# EasyEDA Pro project stm32_无人机.eprj, board PCB1
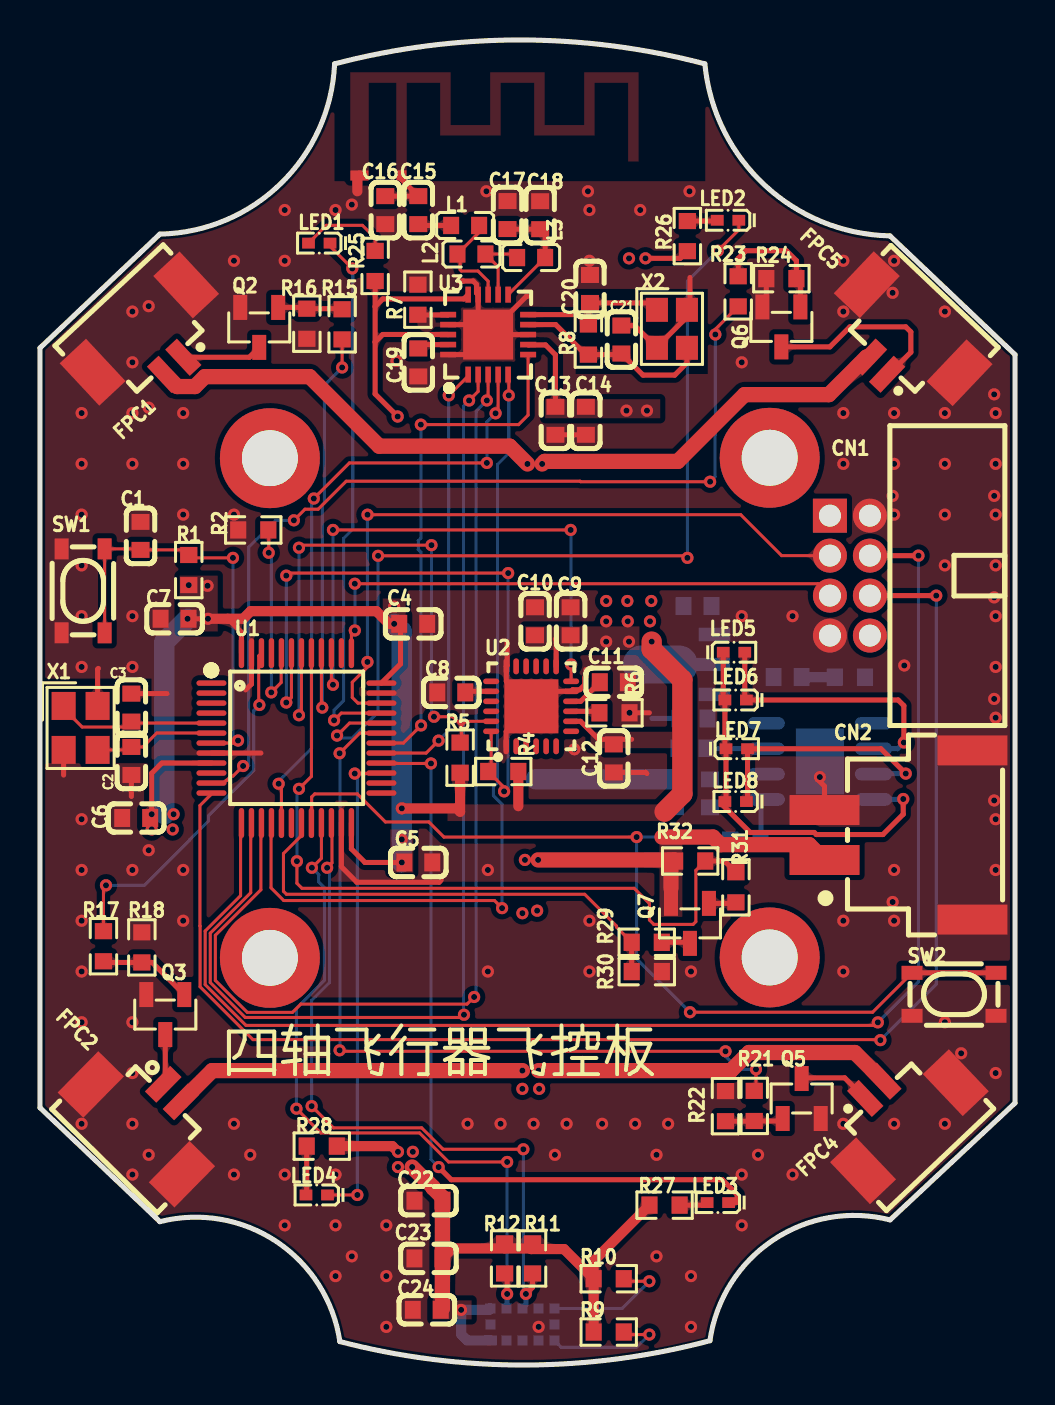
[diagram p11: board, top side]
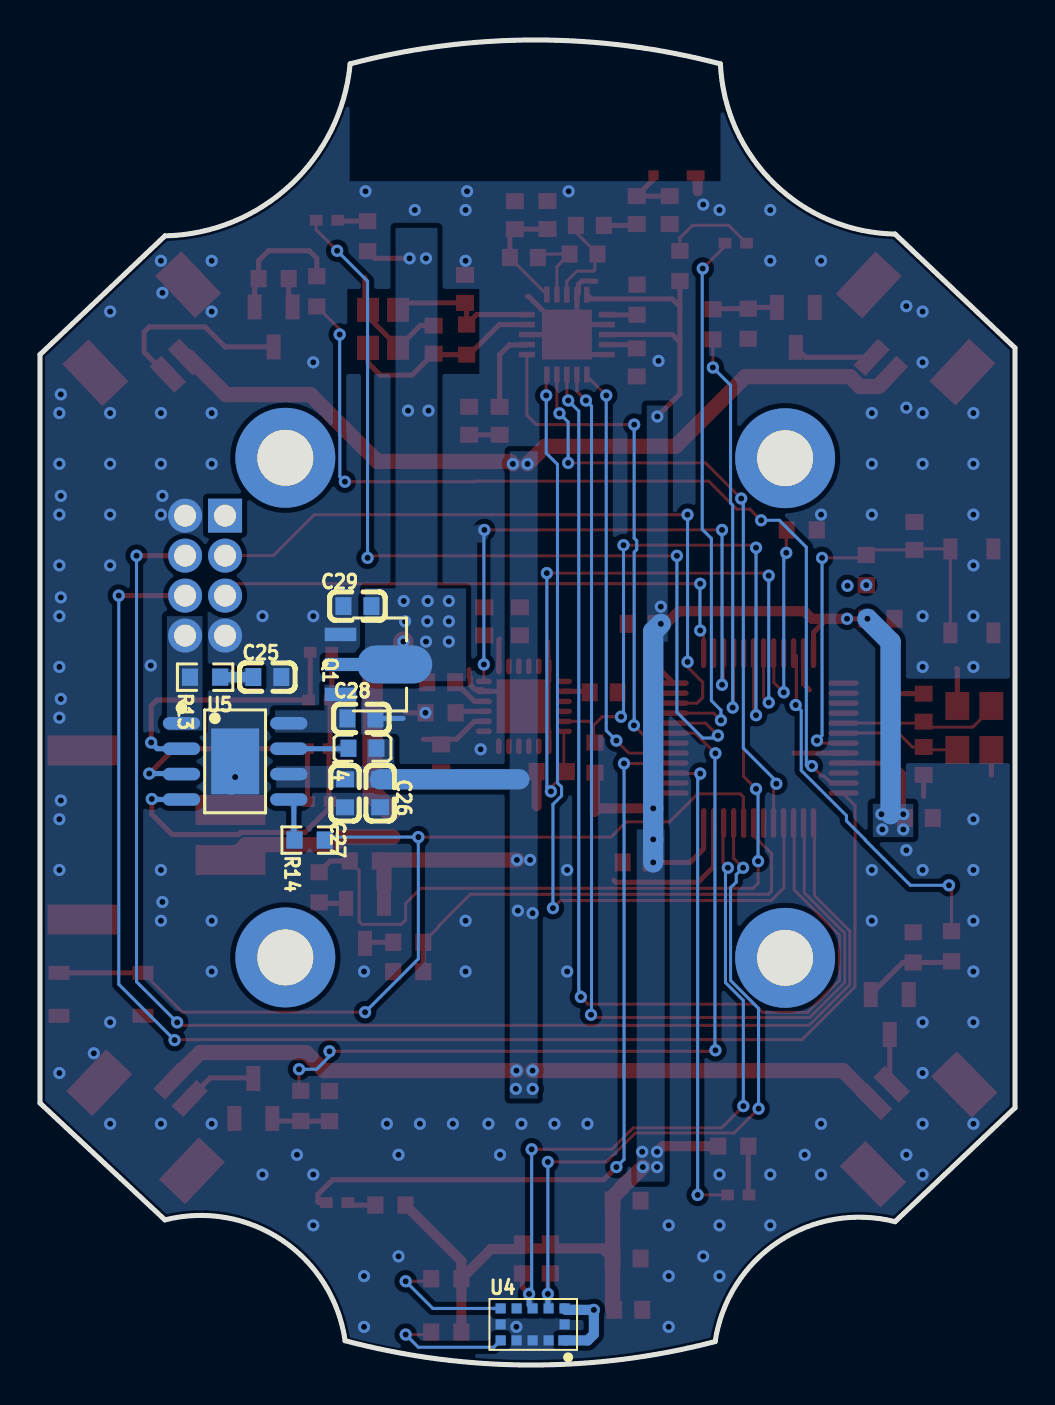
[diagram p12: board, bottom side, seen from below]

Outline 48.77 x 66.3 mm; copper layers: Top Layer, Bottom Layer. Coordinates in mm from the lower left corner of the outline.
Outline path: 0,50.89 6,56.59 arc(12.04,59.11) 14.74,65.1 arc(23.99,66.3) 33.26,65.1 arc(36.26,59.03) 42.52,56.5 48.77,50.55 48.77,13.11 42.52,7.26 arc(36.69,6.26) 33.51,1.22 arc(24.25,0) 15,1.17 arc(11.83,6.17) 6,7.17 0,12.87 0,50.89
Stack: Top Layer 0.035mm / Dielectric1 1.51mm FR4 er 4.5 / Bottom Layer 0.035mm

## Design rules (mm)
template: 自定义配置
spacing copperThickness1oz (default): track to track 0.102, other pairs 0 to 0.3
spacing copperThickness2oz: track to track 0.203, other pairs 0.152 to 0.3
track width copperThickness1oz (default): min 0.127, default 0.254, max 2.54
track width copperThickness2oz: min 0.203, default 0.254, max 2.54
differential pair differentialPair (default): width min 0.127, default 0.254, max 2.54; gap min 0.152, default 0.152
via viaSize (default): diameter min 0.5, default 0.61, max 10; hole min 0.3, default 0.305, max 6.3

## Placement (name value [footprint] x y rotation side)
C1  100nF  [C0603]  5.03 41.49 270 top
C2  12pF  [C0603]  4.57 30.23 90 top
C3  12pF  [C0603]  4.57 32.89 90 top
C4  100nF  [C0603]  18.67 37.08 180 top
C5  100nF  [C0603]  18.92 25.15 180 top
C6  100nF  [C0603]  4.81 27.37 0 top
C7  100nF  [C0603]  6.73 37.34 0 top
C8  10nF  [C0603]  20.57 33.66 180 top
C9  100nF  [C0603]  26.54 37.21 90 top
C10  2.2uF  [C0603]  24.76 37.21 90 top
C11  100nF  [C0603]  28.7 34.16 180 top
C12  10nF  [C0603]  28.7 30.35 270 top
C13  100nF  [C0603]  25.78 47.24 90 top
C14  10uF  [C0603]  27.31 47.24 90 top
C15  1.5pF  [C0603]  18.92 57.79 90 top
C16  1pF  [C0603]  17.27 57.79 90 top
C17  4.7pF  [C0603]  23.39 57.54 270 top
C18  2.2nF  [C0603]  25.02 57.53 270 top
C19  33nF  [C0603]  18.92 50.17 90 top
C20  22pF  [C0603]  27.51 53.84 90 top
C21  22pF  [C0603]  29.08 51.31 270 top
C22  4.7uF  [C0603]  19.43 8.22 0 top
C23  100nF  [C0603]  19.43 5.33 0 top
C24  1pF  [C0603]  19.35 2.76 0 top
C25  2.2uF  [C0603]  37.4 34.42 180 bottom
C26  10uF  [C0603]  31.76 28.61 90 bottom
C27  10uF  [C0603]  33.51 28.61 90 bottom
C28  10uF  [C0603]  32.69 32.35 0 bottom
C29  10uF  [C0603]  32.89 37.97 0 bottom
CN1  3111-08RG0BK00T1  [CONN-TH_3111-08RG0BK00T1]  40.51 39.5 270 top
CN2  ZX-XH2.54-2PWT  [CONN-SMD_2P-P2.54_MEGASTAR_ZX-XH2.54-2PWT]  42.94 26.52 90 top
FPC1  1.25-2PWB  [CONN-SMD_2P-P1.25_DEALON_1.25-2PWB]  5.84 50.93 223 top
FPC2  1.25-2PWB  [CONN-SMD_2P-P1.25_DEALON_1.25-2PWB]  5.72 12.7 315.4 top
FPC4  1.25-2PWB  [CONN-SMD_2P-P1.25_DEALON_1.25-2PWB]  42.61 12.85 43.5 top
FPC5  1.25-2PWB  [CONN-SMD_2P-P1.25_DEALON_1.25-2PWB]  42.8 50.93 136.5 top
L1  3.9nH  [L0603]  21.27 57.02 180 top
L2  8.2nH  [L0603]  21.58 55.59 180 top
L3  2.7nH  [L0603]  24.57 55.41 0 top
L4  1.5uH  [L0603]  32.64 30.86 180 bottom
LED1  XL-1005UYC  [LED0402-FD_YELLOW]  13.97 56.13 0 top
LED2  XL-1005UYC  [LED0402-FD_YELLOW]  34.42 57.28 0 top
LED3  XL-1005UYC  [LED0402-FD_YELLOW]  33.91 8.13 0 top
LED4  XL-1005UYC  [LED0402-FD_YELLOW]  13.84 8.51 0 top
LED5  XL-1005UYC  [LED0402-FD_YELLOW]  34.72 35.66 180 top
LED6  XL-1005UYC  [LED0402-FD_YELLOW]  34.8 33.27 0 top
LED7  XL-1005UYC  [LED0402-FD_YELLOW]  34.85 30.84 180 top
LED8  XL-1005UYC  [LED0402-FD_YELLOW]  34.8 28.19 0 top
NOREF  -  [Pad_e117]  36.5 45.39 0 top
NOREF#2  -  [Pad_e114]  11.5 20.37 0 top
NOREF#3  -  [Pad_e118]  36.5 20.39 0 top
NOREF#4  -  [Pad_e5883]  18.08 59.53 0 top
NOREF#5  -  [Pad_e116]  11.5 45.37 0 top
NOREF#6  -  [Pad_e5882]  15.98 59.52 0 top
Q1  AMS1117-3.3V  [SOT-89-3_L4.5-W2.5-P1.50-LS4.2-BR]  32.38 35.05 0 bottom
Q2  AO3400A  [SOT-23-3_L2.9-W1.3-P1.90-LS2.4-BR]  10.97 51.92 90 top
Q3  AO3400A  [SOT-23-3_L2.9-W1.3-P1.90-LS2.4-BR]  6.27 17.54 90 top
Q5  AO3400A  [SOT-23-3_L2.9-W1.3-P1.90-LS2.4-BR]  38.1 13.34 270 top
Q6  AO3400A  [SOT-23-3_L2.9-W1.3-P1.90-LS2.4-BR]  37.08 51.94 90 top
Q7  SI2301A  [SOT-23-3_L2.9-W1.3-P1.90-LS2.4-BR]  32.51 22.1 90 top
R1  10KΩ  [R0603]  7.44 39.78 270 top
R2  10K  [R0603]  10.67 41.78 180 top
R4  10KΩ  [R0603]  23.17 29.7 0 top
R5  10KΩ  [R0603]  21.01 30.39 270 top
R6  10K  [R0603]  28.74 32.63 180 top
R7  22K  [R0603]  18.9 53.3 90 top
R8  1MΩ  [R0603]  27.43 51.31 90 top
R9  10K  [R0603]  28.45 1.65 0 top
R10  10K  [R0603]  28.45 4.32 0 top
R11  10K  [R0603]  24.64 5.33 270 top
R12  10K  [R0603]  23.24 5.33 270 top
R13  1.5Ω  [R0603]  40.51 34.42 180 bottom
R14  10KΩ  [R0603]  35.28 26.27 180 bottom
R15  1KΩ  [R0603]  15.11 52.07 90 top
R16  10K  [R0603]  13.35 52.1 90 top
R17  1KΩ  [R0603]  3.17 20.96 270 top
R18  10K  [R0603]  5.09 20.9 270 top
R21  1KΩ  [R0603]  35.73 12.96 270 top
R22  10K  [R0603]  34.29 12.95 270 top
R23  1KΩ  [R0603]  34.93 53.72 90 top
R24  10K  [R0603]  37.08 54.36 0 top
R25  10K  [R0603]  16.76 54.99 270 top
R26  10K  [R0603]  32.38 56.49 270 top
R27  10K  [R0603]  31.24 8 180 top
R28  10K  [R0603]  14.09 10.95 0 top
R29  100KΩ  [R0603]  30.35 21.15 0 top
R30  100KΩ  [R0603]  30.35 19.69 180 top
R31  1KΩ  [R0603]  34.81 23.9 90 top
R32  100KΩ  [R0603]  32.52 25.22 0 top
SW1  SKRPACE010  [KEY-SMD_4P-L4.2-W3.2-P2.20-LS4.6]  2.16 38.74 270 top
SW2  SKRPACE010  [KEY-SMD_4P-L4.2-W3.2-P2.20-LS4.6]  45.72 18.55 0 top
U1  STM32F103C8T6  [LQFP-48_L7.0-W7.0-P0.50-LS9.0-BL]  12.83 31.37 270 top
U2  MPU-6050  [QFN-24_L4.0-W4.0-P0.50-BL-EP2.7]  24.57 32.96 0 top
U3  Si24R1  [QFN-20_L4.0-W4.0-P0.50-BL-EP]  22.42 51.56 0 top
U4  VL53L4CDV0DH/1  [LGA-12_L4.4-W2.4_VL53L0X]  24.13 2.03 180 bottom
U5  TP4336  [ESOP-8_L4.9-W3.9-P1.27-LS6.0-BL-EP-1]  39.01 30.2 270 bottom
X1  8MHz  [CRYSTAL-SMD_4P-L3.2-W2.5-BL]  2.03 31.88 270 top
X2  -  [CRYSTAL-SMD_4P-L2.5-W2.0-BL-2]  31.61 51.85 270 top

## Footprints (pads in the part's own frame, mm; a bottom-side part is the same pattern mirrored in y, then rotated)
C0603
  rect 0.8x0.9 smd: 1(-0.7,0) 2(0.7,0)
CONN-SMD_2P-P1.25_DEALON_1.25-2PWB
  rect 0.8x1.8 smd: 1(-0.625,1.275) 2(0.625,1.275)
  rect 1.8x2.9 smd: 3(-3.2,-1.275) 4(3.2,-1.275)
CONN-SMD_2P-P2.54_MEGASTAR_ZX-XH2.54-2PWT
  rect 1.5x3.5 smd: 1(-1.25,3.7) 2(1.25,3.7) 3(-4.23,-3.7) 4(4.23,-3.7)
CONN-TH_3111-08RG0BK00T1
  rect 1.7x1.7 hole 1.1: 1(-3,-1)
  round 1.7 hole 1.1: 2(-3,1) 3(-1,-1) 4(-1,1) 5(1,-1) 6(1,1) 7(3,-1) 8(3,1)
CRYSTAL-SMD_4P-L2.5-W2.0-BL-2
  rect 1.2x1.1 smd: 1(-0.95,-0.75) 2(0.95,-0.75) 3(0.95,0.75) 4(-0.95,0.75)
CRYSTAL-SMD_4P-L3.2-W2.5-BL
  rect 1.4x1.2 smd: 1(-1.1,-0.85) 2(1.1,-0.85) 3(1.1,0.85) 4(-1.1,0.85)
ESOP-8_L4.9-W3.9-P1.27-LS6.0-BL-EP-1
  oval 0.63x1.865 smd: 1(-1.905,-2.683) 2(-0.635,-2.683) 3(0.635,-2.683) 4(1.905,-2.683) 5(1.905,2.683) 6(0.635,2.683) 7(-0.635,2.683) 8(-1.905,2.683)
  rect 3.3x2.4 smd: 9(0,0)
KEY-SMD_4P-L4.2-W3.2-P2.20-LS4.6
  rect 1.05x0.7 smd: 1(-2.1,1.075) 2(2.1,1.075) 3(-2.1,-1.075) 4(2.1,-1.075)
L0603
  rect 0.8x0.864 smd: 1(-0.7,0) 2(0.7,0)
LED0402-FD_YELLOW
  rect 0.636x0.54 smd: 1(-0.538,0) 2(0.538,0)
LGA-12_L4.4-W2.4_VL53L0X
  custom 0.635x0.508 smd: 1(1.6,-0.8)
  rect 0.508x0.508 smd: 2(0.8,-0.8) 3(0,-0.8) 4(-0.8,-0.8) 5(-1.6,-0.8) 6(-1.6,0) 7(-1.6,0.8) 8(-0.8,0.8) 9(0,0.8) 10(0.8,0.8) 11(1.6,0.8) 12(1.6,0)
LQFP-48_L7.0-W7.0-P0.50-LS9.0-BL
  oval 0.27x1.5 smd: 1(-2.75,-4.25) 2(-2.25,-4.25) 3(-1.75,-4.25) 4(-1.25,-4.25) 5(-0.75,-4.25) 6(-0.25,-4.25) 7(0.25,-4.25) 8(0.75,-4.25) 9(1.25,-4.25) 10(1.75,-4.25) 11(2.25,-4.25) 12(2.75,-4.25) 25(2.75,4.25) 26(2.25,4.25) 27(1.75,4.25) 28(1.25,4.25) 29(0.75,4.25) 30(0.25,4.25) 31(-0.25,4.25) 32(-0.75,4.25) 33(-1.25,4.25) 34(-1.75,4.25) 35(-2.25,4.25) 36(-2.75,4.25)
  oval 1.5x0.27 smd: 13(4.25,-2.75) 14(4.25,-2.25) 15(4.25,-1.75) 16(4.25,-1.25) 17(4.25,-0.75) 18(4.25,-0.25) 19(4.25,0.25) 20(4.25,0.75) 21(4.25,1.25) 22(4.25,1.75) 23(4.25,2.25) 24(4.25,2.75) 37(-4.25,2.75) 38(-4.25,2.25) 39(-4.25,1.75) 40(-4.25,1.25) 41(-4.25,0.75) 42(-4.25,0.25) 43(-4.25,-0.25) 44(-4.25,-0.75) 45(-4.25,-1.25) 46(-4.25,-1.75) 47(-4.25,-2.25) 48(-4.25,-2.75)
Pad_e114
  round 5 hole 2.8: 1(0,0)
Pad_e116
  round 5 hole 2.8: 1(0,0)
Pad_e117
  round 5 hole 2.8: 1(0,0)
Pad_e118
  round 5 hole 2.8: 1(0,0)
Pad_e5882
  rect 0.9x0.5 smd: 2(0,0)
Pad_e5883
  rect 0.5x0.5 smd: 1(0,0)
QFN-20_L4.0-W4.0-P0.50-BL-EP
  rect 0.28x0.8 smd: 1(-1,-2) 2(-0.5,-2) 3(0,-2) 4(0.5,-2) 5(1,-2) 11(1,2) 12(0.5,2) 13(0,2) 14(-0.5,2) 15(-1,2)
  rect 0.8x0.28 smd: 6(2,-1) 7(2,-0.5) 8(2,0) 9(2,0.5) 10(2,1) 16(-2,1) 17(-2,0.5) 18(-2,0) 19(-2,-0.5) 20(-2,-1)
  rect 2.5x2.5 smd: 21(0,0)
QFN-24_L4.0-W4.0-P0.50-BL-EP2.7
  oval 0.28x0.8 smd: 1(-1.25,-2) 2(-0.75,-2) 3(-0.25,-2) 4(0.25,-2) 5(0.75,-2) 6(1.25,-2) 13(1.25,2) 14(0.75,2) 15(0.25,2) 16(-0.25,2) 17(-0.75,2) 18(-1.242,2)
  oval 0.8x0.28 smd: 7(2,-1.25) 8(2,-0.75) 9(2,-0.25) 10(2,0.25) 11(2,0.75) 12(2,1.25) 19(-2,1.25) 20(-2,0.75) 21(-2,0.25) 22(-2,-0.25) 23(-2,-0.75) 24(-2,-1.25)
  rect 2.7x2.7 smd: 25(0.013,0)
R0603
  rect 0.806x0.864 smd: 1(-0.753,0) 2(0.753,0)
SOT-23-3_L2.9-W1.3-P1.90-LS2.4-BR
  rect 1.25x0.7 smd: 1(1,-0.95) 2(1,0.95) 3(-1,0)
SOT-89-3_L4.5-W2.5-P1.50-LS4.2-BR
  rect 1.575x0.672 smd: 1(1.356,-1.5) 3(1.356,1.5)
  custom 5.377x1.9 smd: 2(-1.356,0)

## Nets
As in the schematic, except:
GND: C1.1 C2.1 C3.2 C4.1 C5.1 C6.1 C7.1 C8.2 C9.2 C10.2 C11.1 C12.2 C13.1 C14.1 C16.1 C17.1 C18.1 C19.1 C20.2 C21.1 C22.1 C23.1 C24.1 C25.2 C26.1 C27.1 C28.1 C29.2 CN1.2 CN1.7 CN2.2 CN2.3 CN2.4 FPC1.3 FPC1.4 FPC2.3 FPC2.4 FPC4.3 FPC4.4 FPC5.3 FPC5.4 NOREF#6.2 Q1.1 Q2.2 Q3.2 Q5.2 Q6.2 R2.2 R6.1 R7.2 R16.1 R18.1 R22.1 R24.1 R30.1 SW1.3 SW1.4 SW2.3 SW2.4 U1.8 U1.23 U1.35 U1.47 U2.1 U2.11 U2.18 U2.25 U3.8 U3.14 U3.17 U3.20 U3.21 U4.2 U4.3 U4.4 U4.6 U4.12 U5.9 X1.2 X1.4 X2.2 X2.4
AT1: C15.2 C16.2 NOREF#4.1
$1N1084: R2.1 U1.44

Pads without a net: CN1 1; NOREF 1; NOREF#2 1; NOREF#3 1; NOREF#5 1; U1 1 2 3 4 10 18 25 26 38 45; U2 2 3 4 5 6 7 14 15 16 17 19 21 22; U4 8

## Via types
v1: diameter 0.61, hole 0.305, Top Layer to Bottom Layer, 245 vias

## Routing (per net, layer and track width the routed paths; a pad name or vN(x,y) marks a point on that pad's centre or on a via; arc(x,y) is an arc through that point)
3V3: length 122.6
  Top Layer w0.254: U3.15 21.2,53.34 17.15,53.34 16.76,52.96 ; R26.2 32.02,55.37 v1(30.29,55.37) ; C5.2 16.26,25.15 15.58,25.83 U1.24 ; C13.2 25.78,50.55 25.29,51.04 24.43,51.04 U3.7 ; 25.78,36.32 25.82,36.28 U2.13 ; U1.48 10.08,36.66 9.4,37.34 ; 18.03,37.02 18.03,35.08 U1.36 ; 16.76,51.18 17.15,51.56 20.41,51.56 U3.18 ; 16.76,51.18 16.76,52.96 ; 16.76,51.18 16.76,48.59 v1(17.89,47.46) ; 16.76,52.96 R25.2 ; v1(8.4,37.34) C7.2 ; U2.8 27.04,32.21 27.94,31.31 29.59,31.31 ; U1.9 6.1,30.12 5.59,29.61 v1(5.59,27.56)
  Top Layer w0.508: 17.97,37.08 17.46,37.08 16.83,37.72 10.54,37.72 10.16,37.34 v1(8.4,37.34) ; R27.2 27.69,5.21 R10.1 ; R10.1 R9.1 ; R10.1 26.21,5.8 24.58,5.8 24.54,5.83 20.63,5.83 20.13,5.34 ; 21.01,29.64 21.01,27.69 20.85,27.85 v1(18.1,27.85) ; R28.2 17.62,10.95 v1(17.91,10.67) ; 23.93,27.96 R4.2
  Top Layer w0.762: C24.2 20.13,2.84 C23.2 ; v1(18.62,9.91) 19.32,9.21 19.35,9.21 19.66,8.89 19.66,8.86 20.13,8.39 C22.2 20.13,5.34
  Top Layer w1.016: v1(30.6,36.2) 30.6,35.81 32.13,34.28 32.13,28.58 31.24,27.69
  Bottom Layer w0.508: U4.11 22.46,2.76 v1(21.07,2.76) 21.07,1.54 21.37,1.23 22.53,1.23
  Bottom Layer w1.016: 6.22,27.56 6.22,36.18 v1(7.38,37.34) ; v1(17.72,37.08) 18.1,36.7 v1(18.1,27.85) v1(18.1,26.3) v1(18.1,25.15)
  vias: v1(5.59,26.8) v1(6.64,26.8) v1(6.68,27.56) v1(7.44,39.02) v1(8.38,38.99) v1(17.72,37.94) v1(17.91,9.91) v1(18.65,10.67) v1(28.32,38.23) v1(28.32,37.21) v1(28.32,36.2) v1(29.34,47.75) v1(29.38,38.23) v1(29.4,37.21) v1(29.46,55.37) v1(29.46,36.2) v1(30.36,47.75) v1(30.51,37.21) v1(30.58,38.23)
GND: length 55.7
  Top Layer w0.254: C12.2 30.29,29.65 30.35,29.59 ; 20.07,24.26 19.97,24.16 15.85,24.16 15.08,24.93 U1.23 ; U3.21 21.42,50.56 U3.20 ; U3.21 24.33,53.47 24.38,53.47 ; U3.21 U3.8 ; Q6.2 36.33,53.14 R24.1 ; C2.1 4.57,28.45 ; U2.25 23.32,31.7 U2.1 ; U2.25 23.33,34.21 U2.18 23.37,35 23.37,36.2 ; U2.25 25.33,33.71 U2.11 26.65,33.79 27,33.79 27.25,34.03 27.25,34.39 27.31,34.44 27.31,34.8 ; 20.96,54.23 21.15,54.23 21.16,54.24 21.67,54.24 21.84,54.07 21.84,53.64 U3.14 21.92,52.06 U3.17 ; C3.2 6.35,33.59 ; U1.8 11.05,30.62 ; X1.4 2.88,34.81 2.92,34.85 ; C21.1 29.75,52.01 X2.2 30.86,50.94 32.36,52.44 X2.4 32.51,52.95 32.51,54.41 ; 38.99,29.21 39.24,28.96 39.24,27.77 ; 25.78,46.54 27.31,46.54 ; v1(29.49,32.63) 30.48,32.63 ; U1.47 10.58,34.07 10.29,33.78 ; X1.2 1.18,29.52
  Top Layer w0.508: 15.88,58.73 15.88,59.41 NOREF#6.2
  Bottom Layer w0.254: C28.1 30.61,32.35
  vias: v1(2.08,47.63) v1(2.08,45.09) v1(2.08,42.55) v1(2.08,40.01) v1(2.08,37.47) v1(2.08,34.93) v1(2.08,27.31) v1(2.08,24.77) v1(2.08,22.23) v1(2.08,19.69) v1(2.08,17.15) v1(2.08,12.07) v1(4.62,52.71) v1(4.62,50.17) v1(4.62,47.63) v1(4.62,45.09) v1(4.62,37.47) v1(4.62,34.93) v1(4.62,24.77) v1(4.62,17.15) v1(4.62,14.61) v1(4.62,12.07) v1(4.62,9.53) v1(5.44,52.98) v1(5.44,47.9) v1(5.44,25.76) v1(5.44,10.52) v1(7.16,47.63) v1(7.16,45.09) v1(7.16,42.55) v1(7.16,24.77) v1(7.16,22.23) v1(9.7,55.25) v1(9.7,42.55) v1(9.7,12.07) v1(9.7,9.53) v1(10.52,10.52) v1(12.24,57.79) v1(12.24,55.25) v1(12.24,9.53) v1(12.24,6.99) v1(14.78,57.79) v1(14.78,9.53) v1(14.78,6.99) v1(14.78,4.45) v1(15.6,58.06) v1(15.6,5.44) v1(17.32,6.99) v1(17.32,4.45) v1(17.32,1.91) v1(17.83,50.24) v1(21.39,12.07) v1(22.33,58.73) v1(22.4,24.77) v1(22.4,19.69) v1(23.04,12.07) v1(24.69,12.07) v1(24.94,1.91) v1(25.76,10.52) v1(26.34,12.07) v1(26.73,30.81) v1(27.41,58.73) v1(27.48,57.79) v1(27.48,55.25) v1(27.48,22.23) v1(27.48,19.69) v1(28.12,12.07) v1(29.77,12.07) v1(30.02,57.79) v1(30.84,10.52) v1(30.84,5.44) v1(31.42,12.07) v1(32.49,58.73) v1(32.56,19.69) v1(32.56,4.45) v1(32.56,1.91) v1(35.1,50.17) v1(35.1,37.47) v1(35.1,9.53) v1(35.1,6.99) v1(35.92,10.52) v1(37.64,37.47) v1(37.64,9.53) v1(39.01,29.42) v1(40.18,55.25) v1(40.18,52.71) v1(40.18,47.63) v1(40.18,45.09) v1(40.18,22.23) v1(40.18,19.69) v1(40.18,12.07) v1(42.65,53.65) v1(42.65,43.49) v1(42.65,23.17) v1(42.72,55.25) v1(42.72,47.63) v1(42.72,45.09) v1(42.72,42.55) v1(42.72,24.77) v1(42.72,22.23) v1(42.72,12.07) v1(43.23,35) v1(45.26,52.71) v1(45.26,47.63) v1(45.26,45.09) v1(45.26,42.55) v1(45.26,40.01) v1(45.26,17.15) v1(45.26,12.07) v1(46.08,15.6) v1(47.73,48.57) v1(47.73,43.49) v1(47.73,38.41) v1(47.73,33.33) v1(47.73,28.25) v1(47.8,47.63) v1(47.8,45.09) v1(47.8,42.55) v1(47.8,40.01) v1(47.8,37.47) v1(47.8,34.93) v1(47.8,32.39) v1(47.8,27.31) v1(47.8,24.77) v1(47.8,14.61)
VBAT: length 98.8
  Top Layer w0.762: v1(24.13,14.73) 8.62,14.73 7.06,13.17 ; v1(25.12,45.09) 25.25,45.21 31.9,45.21 35.24,48.55 39.46,48.55 41.34,50.43 FPC5.2 ; v1(24.38,45.09) 23.5,45.97 16.97,45.97 13.49,49.45 8.25,49.45 7.75,48.96 6.87,48.96 FPC1.2 ; v1(24.92,25.27) 31.71,25.27 R32.1 31.56,25.01 31.56,23.86 ; 31.12,26.42 33.67,26.42 34.05,26.04 38.48,26.04 CN2.1 ; v1(24.94,14.73) 34.56,14.73 35.47,15.64 40.75,15.64 42.19,14.2
  Bottom Layer w1.016: 24.79,29.31 C26.2
  vias: v1(24.13,22.61) v1(24.13,13.82) v1(24.26,25.27) v1(24.87,22.73) v1(24.97,13.82)
AT1: length 3
  Top Layer w0.254: C16.2 C15.2 18.08,59.33 NOREF#4.1
BAT-ADC-EN: length 38.2
  Top Layer w0.152: v1(12.95,28.83) 13.58,29.45 U1.41 ; v1(12.85,25.21) 12.85,24.11 13.11,23.85 29.72,23.85 30.49,23.09 30.49,22.27 30.71,22.05 32.67,22.05 32.81,22.18 32.81,24.75 33.28,25.22
  Top Layer w0.254: 33.28,25.22 34.25,25.22 R31.2
  Bottom Layer w0.152: v1(12.95,28.83) 12.85,28.73 v1(12.85,25.21)
BAT_DET: length 23.8
  Top Layer w0.152: U1.19 13.08,26.49 12.18,25.59 12.18,23.71 12.33,23.55 27.25,23.55 28.84,21.97 28.84,21.91 R29.1
  Top Layer w0.254: R29.1 29.6,19.69 R30.2
I2C1-SCL: length 30.9
  Top Layer w0.152: v1(19.58,41.02) 13.08,41.02 v1(12.95,40.89) ; 21.08,32 21.08,31.21 R5.1 ; 21.08,32 20.65,32.44 v1(19.71,32.44) ; 21.08,32 21.29,32.21 U2.23 ; U1.42 13.08,32.64 v1(12.95,32.51)
  Bottom Layer w0.152: v1(12.95,40.89) v1(12.95,32.51) ; v1(19.58,41.02) 19.58,32.56 v1(19.71,32.44)
I2C1-SDA: length 34.5
  Top Layer w0.152: U1.43 12.58,33.41 v1(12.32,33.15) ; v1(23.22,28.7) 23.22,28.9 R4.1 22.57,29.85 U2.24 ; v1(12.32,39.5) 12.45,39.62 v1(23.42,39.62)
  Bottom Layer w0.152: v1(23.22,28.7) 23.42,28.91 v1(23.42,39.62) ; v1(12.32,39.5) v1(12.32,33.15)
I2C2-SCL: length 35.4
  Top Layer w0.152: v1(12.83,12.83) 14.04,11.61 18.99,11.61 20.44,10.16 v1(23.37,10.16) ; v1(13.6,24.88) 14.08,25.36 U1.21
  Top Layer w0.254: R12.2 23.37,4.45 v1(23.37,3.56)
  Bottom Layer w0.152: v1(13.6,24.88) 13.94,24.54 13.94,24.16 14.23,23.88 14.23,19.24 12.83,17.84 v1(12.83,12.83) ; v1(23.37,3.56) v1(23.37,10.16)
  Bottom Layer w0.254: v1(23.37,3.56) 23.37,2.87 U4.10
I2C2-SDA: length 35.4
  Top Layer w0.152: U1.22 14.6,27.09 14.6,25.12 v1(14.36,24.88) ; v1(24.18,10.8) 20.16,10.8 19.09,11.87 14.68,11.87 v1(13.59,12.95)
  Top Layer w0.254: v1(24.31,3.56) 24.64,3.89 R11.2
  Bottom Layer w0.152: v1(14.36,24.88) 14.48,24.76 14.48,19.14 13.59,18.24 v1(13.59,12.95) ; v1(24.31,3.56) 24.18,3.68 v1(24.18,10.8)
  Bottom Layer w0.254: U4.9 24.31,3.01 v1(24.31,3.56)
LED1: length 27.3
  Top Layer w0.152: v1(14.71,32.26) 15.07,32.62 U1.33 ; LED1.2 14.51,55.98 v1(15.62,54.86)
  Bottom Layer w0.152: v1(14.71,32.26) 14.71,32.77 15.19,33.24 15.19,41.36 15.65,41.82 15.65,54.84 v1(15.62,54.86)
LED2: length 46.4
  Top Layer w0.152: v1(16.91,40.49) 32.28,40.49 v1(32.38,40.39) ; LED2.2 34.96,56.8 v1(33.91,55.75) ; U1.32 15.48,32.12 v1(14.86,31.5)
  Bottom Layer w0.152: v1(32.38,40.39) 32.38,54.23 v1(33.91,55.75) ; v1(16.91,40.49) 16.91,32.66 15.62,31.37 14.99,31.37 v1(14.86,31.5)
LED3: length 39.1
  Top Layer w0.152: v1(19.56,30.1) 17.1,30.1 U1.28
  Top Layer w0.254: LED3.2 34.83,8.13 34.87,8.17 34.87,8.53 34.13,9.27 20.57,9.27 v1(19.94,9.91)
  Bottom Layer w0.152: v1(19.56,30.1) 19.56,10.29 v1(19.94,9.91)
LED4: length 24
  Top Layer w0.152: U1.27 17.05,29.59 v1(15.75,29.59) ; LED4.2 v1(15.88,8.51)
  Bottom Layer w0.152: v1(15.88,8.51) 15.88,29.46 v1(15.75,29.59)
LEFT-0: length 21.6
  Top Layer w0.152: R15.1 v1(15.11,49.91) ; v1(14.12,32.89) 14.08,32.94 U1.40
  Bottom Layer w0.152: v1(15.11,49.91) 14.23,49.03 14.23,43.13 14.12,43.03 v1(14.12,32.89)
LEFT-1: length 18.3
  Top Layer w0.152: v1(10.97,33.02) 10.94,33.06 10.94,35.48 U1.46 ; R17.1 3.17,23.88 v1(3.3,24)
  Bottom Layer w0.152: v1(10.97,33.02) 10.69,32.75 10.69,29.75 8.43,27.49 8.43,27.23 7.49,26.28 7.49,26.26 5.23,24 v1(3.3,24)
MPU_INT: length 28.8
  Top Layer w0.152: v1(26.54,41.78) v1(14.66,41.78) ; U1.39 14.58,34.11 v1(14.66,34.04) ; U2.12 v1(26.57,35.05)
  Bottom Layer w0.152: v1(26.57,35.05) 26.57,41.76 v1(26.54,41.78) ; v1(14.66,41.78) v1(14.66,34.04)
NRST: length 21.4
  Top Layer w0.152: v1(9.65,40.39) 7.58,40.39 R1.1 7.19,40.79 C1.2 4.98,40.84 SW1.1 SW1.2 ; U1.7 9.78,31.12 v1(9.91,31.25)
  Bottom Layer w0.152: v1(9.65,40.39) 9.65,31.5 v1(9.91,31.25)
OSC_IN: length 8
  Top Layer w0.152: X1.1 1.18,32.85 2.11,31.92 4.17,31.92 4.44,32.19 C3.1 4.65,32.12 U1.5
OSC_OUT: length 6
  Top Layer w0.152: U1.6 8.57,31.62 5.84,31.62 5.14,30.93 C2.2 4.42,30.78 X1.3
PA1: length 47
  Top Layer w0.152: U1.11 9.18,29.12 9.32,29.26 9.34,29.26 9.56,29.47 9.66,29.47 v1(10.16,29.97) ; v1(33.52,44.2) 27.04,44.2 27.02,44.22 15.32,44.22 13.92,42.82 13.26,42.82 v1(12.7,42.27) ; v1(33.78,51.56) 33.78,51.82 R23.1
  Bottom Layer w0.152: v1(33.78,51.56) 33.78,46.53 33.77,46.52 33.77,44.45 v1(33.52,44.2) ; v1(10.16,29.97) 10.41,29.97 10.44,30 10.44,40.92 11.78,42.27 v1(12.7,42.27)
PA2: length 71.8
  Top Layer w0.152: v1(42.04,16.26) 42.01,16.28 10.65,16.28 8.01,18.93 8.01,21.96 8,21.97 8,27.99 8.58,28.57 U1.12
  Top Layer w0.254: CN1.6 v1(44.83,38.5)
  Bottom Layer w0.152: v1(44.83,38.5) 44.83,19.05 v1(42.04,16.26)
PA3: length 70
  Top Layer w0.152: U1.13 10.03,27.08 10.03,23.48 8.26,21.71 8.26,19.03 10.3,16.99 41.76,16.99 v1(41.91,17.15)
  Top Layer w0.254: CN1.4 v1(43.94,40.5)
  Bottom Layer w0.152: v1(41.91,17.15) 43.94,19.18 v1(43.94,40.5)
PA4: length 54.6
  Top Layer w0.152: v1(21.21,17.53) 21.07,17.39 10.26,17.39 8.52,19.14 8.52,21.61 10.54,23.63 10.54,27.08 U1.14 ; U3.2 21.92,48.71 v1(21.46,48.26)
  Bottom Layer w0.152: v1(21.21,17.53) 21.18,17.55 21.18,47.98 v1(21.46,48.26)
PA5: length 54.2
  Top Layer w0.152: U3.3 22.42,48.32 v1(22.35,48.26) ; U1.15 11.05,27.09 11.05,23.78 8.77,21.5 8.77,19.24 10.37,17.65 12.63,17.65 13.04,18.06 21.36,18.06 v1(21.72,18.42)
  Bottom Layer w0.152: v1(22.35,48.26) 21.82,47.73 21.82,18.52 v1(21.72,18.42)
PA6: length 42.4
  Top Layer w0.152: U3.5 23.45,49.52 v1(23.45,48.51) ; U1.16 11.56,27.1 11.56,23.88 12.19,23.24 22.73,23.24 v1(23.11,22.86)
  Bottom Layer w0.152: v1(23.45,48.51) 23.45,45.63 22.89,45.06 22.89,29.13 22.68,28.92 22.68,28.48 23.11,28.05 v1(23.11,22.86)
PA7: length 31.1
  Top Layer w0.152: v1(13.7,43.35) 15.48,45.14 v1(22.35,45.14) ; v1(11.94,29.08) 12.08,28.94 U1.17 ; U3.4 22.92,47.75 v1(22.79,47.62)
  Bottom Layer w0.152: v1(11.94,29.08) 11.94,29.21 13.59,30.86 13.59,43.25 v1(13.7,43.35) ; v1(22.35,45.14) 22.35,47.18 v1(22.79,47.62)
PA8: length 22
  Top Layer w0.152: v1(19.94,31.24) 19.32,30.62 U1.29 ; U3.1 21.42,49.48 v1(20.45,48.51)
  Bottom Layer w0.152: v1(20.45,48.51) 20.45,31.75 v1(19.94,31.24)
PA9: length 26.1
  Top Layer w0.152: U3.6 24.42,47.53 23.94,47.05 v1(19.05,47.05) ; v1(19.06,32) 18.18,31.12 U1.30
  Bottom Layer w0.152: v1(19.06,32) 19.05,32.02 19.05,40.67 18.92,40.8 18.92,41.24 19.05,41.37 v1(19.05,47.05)
PA10: length 39.9
  Top Layer w0.152: R21.1 35.81,13.8 v1(35.81,14.8) ; U1.31 16,31.62 v1(14.99,30.61) ; v1(14.99,15.75) 15.04,15.7 v1(34.29,15.7)
  Bottom Layer w0.152: v1(35.81,14.8) 34.94,14.8 34.29,15.44 v1(34.29,15.7) ; v1(14.99,30.61) 15.01,30.58 15.01,15.77 v1(14.99,15.75)
PA13: length 35
  Top Layer w0.152: CN1.3 37.1,40.5 35.05,42.55 v1(16.38,42.55) ; v1(16.38,35.18) 16.38,34.92 15.62,34.16 15.62,33.4 15.9,33.12 U1.34
  Bottom Layer w0.152: v1(16.38,42.55) 16.38,42.54 v1(16.38,35.18)
PA14: length 27.6
  Top Layer w0.152: v1(15.75,39.09) 38.92,39.09 CN1.5 ; U1.37 15.58,36.58 v1(15.75,36.75)
  Bottom Layer w0.152: v1(15.75,39.09) 15.76,39.08 15.76,36.77 v1(15.75,36.75)
PB2: length 49.3
  Top Layer w0.152: v1(32.51,17.65) 41.65,17.65 SW2.1 ; v1(29.84,26.42) 20.21,26.42 19.45,27.17 17.28,27.17 15.88,28.58 13.74,28.58 13.59,28.42 13.59,27.13 U1.20
  Top Layer w0.254: SW2.1 SW2.2
  Bottom Layer w0.152: R14.2 34.38,26.42 v1(29.84,26.42) 29.84,20.32 v1(32.51,17.65)
PB12: length 6.5
  Top Layer w0.152: v1(30.48,1.52) 29.33,1.52 R9.2
  Bottom Layer w0.152: v1(30.48,1.52) 29.84,0.89 26.07,0.89 25.73,1.23
PB13: length 6.6
  Top Layer w0.152: v1(30.48,4.19) 29.33,4.19 R10.2
  Bottom Layer w0.152: U4.7 29.12,2.83 v1(30.48,4.19)
XI: length 7.8
  Top Layer w0.254: X2.1 30.52,53.14 C20.1 27.43,53.06 R8.2 26.94,52.56 U3.10
XO: length 9.9
  Top Layer w0.254: R8.1 29.03,50.55 C21.2 30.16,49.53 31.75,49.53 32.36,50.14 X2.3 ; 27.31,50.55 25.79,52.06 U3.9
$1N1084: length 10.4
  Top Layer w0.152: R2.1 11.44,41.76 v1(11.44,40.64) ; v1(11.57,33.66) 12.06,34.15 12.06,35.61 U1.44
  Bottom Layer w0.152: v1(11.44,40.64) 11.57,40.51 v1(11.57,33.66)
$1N2794: length 2.5
  Top Layer w0.254: R28.1 13.34,8.55 LED4.1
$1N2801: length 4.6
  Top Layer w0.152: LED1.1 14.32,57.02 16.13,57.02 16.76,56.39 R25.1
$1N2810: length 1.5
  Top Layer w0.254: R26.1 33.84,57.24 LED2.1
$1N2814: length 1.4
  Top Layer w0.254: 33.37,8.13 33.24,8 R27.1
$1N3111: length 1.4
  Top Layer w0.254: R29.2 32.46,21.15 Q7.3
$1N3224: length 1.4
  Top Layer w0.254: Q7.1 34.76,23.1 R31.1
$2N428: length 1.3
  Top Layer w0.254: 21.28,33.65 21.34,33.71 U2.20
$2N624: length 1.8
  Top Layer w0.254: C11.2 27.05,33.21 U2.10
$2N708: length 1.4
  Top Layer w0.254: U2.9 27.91,32.71 R6.2
$3N804: length 5
  Top Layer w0.152: L1.1 21.97,56.67 L2.2 21.02,55.45 21.02,54.8 21.08,54.74 21.91,54.74 22.42,54.23 U3.13
$3N836: length 1.7
  Top Layer w0.254: L1.2 18.99,57.02 C15.1
$3N1010: length 4
  Top Layer w0.152: L3.1 23.69,55.59 L2.1 22.92,54.95 U3.12
$3N1134: length 5.8
  Top Layer w0.152: U3.11 25.27,55.41
  Top Layer w0.254: C17.2 23.39,56.83 C18.2 25.27,56.58 L3.2
$3N1431: length 1.4
  Top Layer w0.254: U3.16 20.4,52.54 19.02,52.54
$3N1484: length 1.4
  Top Layer w0.254: 18.99,51.05 18.99,51.06 U3.19
$5N366: length 20.4
  Top Layer w0.254: v1(43.18,28.32) 43.18,27.56 42.16,26.54 38.83,26.54 38.73,26.65 35.52,26.65 34.13,28.03 34.13,28.07 LED8.1 34.32,28.25 LED7.2 34.26,30.89 LED6.1 34.18,33.36 LED5.2
  Bottom Layer w0.254: v1(43.18,28.32) 43.16,28.3 41.44,28.3
$5N397: length 12.7
  Top Layer w0.254: v1(43.31,29.59) 42.06,30.84 LED7.1 35.39,28.25 LED8.2
  Bottom Layer w0.254: v1(43.31,29.59) 41.72,29.59 U5.3
$5N414: length 14.2
  Top Layer w0.254: LED5.1 35.25,33.36 LED6.2 42.93,33.27 43.21,32.99 v1(43.21,31.15)
  Bottom Layer w0.254: v1(43.21,31.15) 42.9,30.84 41.44,30.84
$5N509: length 1.7
  Bottom Layer w0.508: R13.2 38.1,34.42 C25.1
$5N790: length 2.9
  Bottom Layer w0.254: 36.07,30.84 33.24,30.84 33.21,30.86
$5N872: length 2
  Bottom Layer w0.254: 36.07,28.3 36.07,26.3 R14.1
$6N230: length 4
  Top Layer w0.254: Q2.3 10.47,50.42 FPC1.1
$6N326: length 3.2
  Top Layer w0.254: R15.2 15.08,52.86 R16.2 13.29,52.92 Q2.1
$6N594: length 2.5
  Top Layer w0.254: Q3.3 6.27,14.15 FPC2.1
$6N597: length 4.7
  Top Layer w0.254: R17.2 3.23,20.14 R18.2 5.61,20.14 Q3.1
$6N982: length 3.6
  Top Layer w0.254: 38.1,14.37 40.25,14.37 FPC4.1
$6N985: length 2.9
  Top Layer w0.254: R22.2 35.72,12.2 R21.2 37.03,12.21 Q5.1
$6N1176: length 9.7
  Top Layer w0.254: Q6.3 39.51,50.94 40.51,51.94 43.31,51.94 43.56,51.69 43.56,50.67 42.46,49.57 FPC5.1
$6N1179: length 6.6
  Top Layer w0.254: Q6.1 38.03,54.16 R24.2 37.84,55.25 37.34,55.75 35.31,55.75 34.93,55.37 R23.2

## Copper pours and planes (outline as drawn; the poured copper is in the pictures)
3V3 on Top Layer: 17.15,38.35 18.29,38.35 18.29,36.45 17.15,36.45
3V3 on Top Layer: 6.98,39.5 8.89,39.5 8.89,36.7 6.98,36.7
3V3 on Top Layer: 17.53,26.8 18.67,26.8 18.67,24.64 17.53,24.64
3V3 on Top Layer: 20.38,28.05 31.36,28.05 31.36,27.22 20.38,27.22
3V3 on Top Layer: 19.63,3.23 21.59,3.23 21.59,2.29 19.63,2.29
3V3 on Top Layer: 25.27,48.32 31.02,48.32 31.02,47.37 25.27,47.37
3V3 on Top Layer: 24.26,36.96 29.99,36.96 29.99,35.77 24.26,35.77
3V3 on Top Layer: 27.54,31.69 32.64,31.69 32.64,30.87 27.54,30.87
3V3 on Bottom Layer: 5.09,28.08 7.11,28.08 7.11,26.42 5.09,26.42
3V3 on Bottom Layer: 17.37,48.01 18.41,48.01 18.41,36.19 17.37,36.19
3V3 on Bottom Layer: 28.89,56.9 30.99,56.9 30.99,35.77 28.89,35.77
3V3 on Bottom Layer: 17.53,26.8 18.92,26.8 18.92,9.17 17.53,9.17
3V3 on Bottom Layer: 27.46,38.86 32.51,38.86 32.51,34.22 27.46,34.22
+5V on Bottom Layer: 32.99,32.75 37.02,32.75 37.02,31.64 32.99,31.64
+5V on Bottom Layer: 32.97,34.04 34.54,34.04 34.54,31.64 32.97,31.64
GND on Top Layer: -5.08,68.38 53.09,68.38 53.09,-1.72 -5.08,-1.72
GND on Bottom Layer: -1.52,68.13 51.56,68.13 51.56,-1.34 -1.52,-1.34
VBAT on Top Layer: 30.99,26.8 32.13,26.8 32.13,22.42 30.99,22.42
VBAT on Bottom Layer: 23.88,45.72 25.27,45.72 25.27,13.34 23.88,13.34
VBAT on Bottom Layer: 31.05,29.97 36.96,29.97 36.96,28.89 31.05,28.89
VBAT on Bottom Layer: 31.05,31.33 32.41,31.33 32.41,28.89 31.05,28.89
VCC on Bottom Layer: 40.64,37.47 42.42,37.47 42.42,31.75 40.64,31.75
AT1 on Top Layer: 15.52,64.68 29.94,64.68 29.94,59.27 15.52,59.27

Small or netless copper shapes (teardrops, artwork), in the pictures only: 322 on Top Layer, 88 on Bottom Layer

## Text on the board
Top Silkscreen Layer: 四轴飞行器飞控板
